# EAGLE design ControllerBoard 2 (EAGLE 5.03)
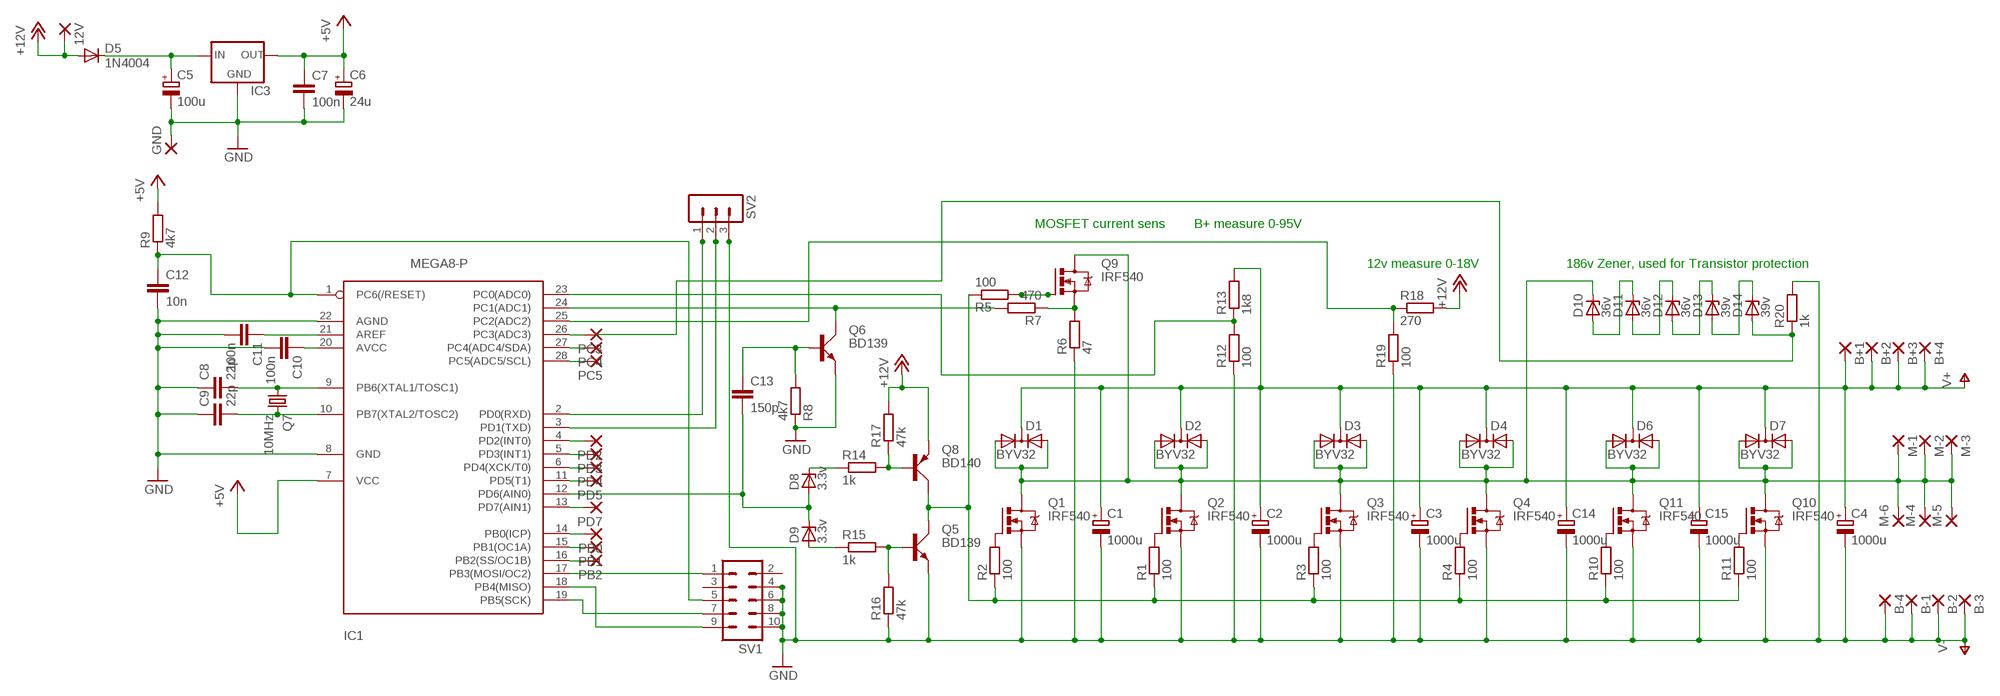
[diagram p0: schematic, sheet 1]

## Parts
12V  3,81/1,4  [3,81/1,4]
B+1  3,81/1,4  [3,81/1,4]
B+2  3,81/1,4  [3,81/1,4]
B+3  3,81/1,4  [3,81/1,4]
B+4  3,81/1,4  [3,81/1,4]
B-1  3,81/1,4  [3,81/1,4]
B-2  3,81/1,4  [3,81/1,4]
B-3  3,81/1,4  [3,81/1,4]
B-4  3,81/1,4  [3,81/1,4]
C1  1000u  CPOL-EUE7.5-16  [E7,5-16]
C2  1000u  CPOL-EUE7.5-16  [E7,5-16]
C3  1000u  CPOL-EUE7.5-16  [E7,5-16]
C4  1000u  CPOL-EUE7.5-16  [E7,5-16]
C5  100u  CPOL-EUE2.5-5  [E2,5-5]
C6  24u  CPOL-EUE2.5-5  [E2,5-5]
C7  100n  C-EU025_050-045X075  [C025_050-045X075]
C8  22p  C-EU025_050-045X075  [C025_050-045X075]
C9  22p  C-EU025_050-045X075  [C025_050-045X075]
C10  100n  C-EU025_050-045X075  [C025_050-045X075]
C11  100n  C-EU025_050-045X075  [C025_050-045X075]
C12  10n  C-EU025_050-045X075  [C025_050-045X075]
C13  150p  C-EU025_050-045X075  [C025_050-045X075]
C14  1000u  CPOL-EUE7.5-16  [E7,5-16]
C15  1000u  CPOL-EUE7.5-16  [E7,5-16]
D1  BYV32  [TO220ABS]
D2  BYV32  [TO220ABS]
D3  BYV32  [TO220ABS]
D4  BYV32  [TO220ABS]
D5  1N4004  [DO41-10]
D6  BYV32  [TO220ABS]
D7  BYV32  [TO220ABS]
D8  3.3v  BZX55  [DO35Z10]
D9  3.3v  BZX55  [DO35Z10]
D10  36v  BZX55  [DO35Z10]
D11  36v  BZX55  [DO35Z10]
D12  36v  BZX55  [DO35Z10]
D13  39v  BZX55  [DO35Z10]
D14  39v  BZX55  [DO35Z10]
GND  3,81/1,4  [3,81/1,4]
IC1  MEGA8-P  [DIL28-3]
IC3  78XXS  [78XXS]
M-1  3,81/1,4  [3,81/1,4]
M-2  3,81/1,4  [3,81/1,4]
M-3  3,81/1,4  [3,81/1,4]
M-4  3,81/1,4  [3,81/1,4]
M-5  3,81/1,4  [3,81/1,4]
M-6  3,81/1,4  [3,81/1,4]
PB0  1,6/0,9  [1,6/0,9]
PB1  1,6/0,9  [1,6/0,9]
PB2  1,6/0,9  [1,6/0,9]
PC3  1,6/0,9  [1,6/0,9]
PC4  1,6/0,9  [1,6/0,9]
PC5  1,6/0,9  [1,6/0,9]
PD2  1,6/0,9  [1,6/0,9]
PD3  1,6/0,9  [1,6/0,9]
PD4  1,6/0,9  [1,6/0,9]
PD5  1,6/0,9  [1,6/0,9]
PD7  1,6/0,9  [1,6/0,9]
Q1  IRF540  [TO220BV]
Q2  IRF540  [TO220BV]
Q3  IRF540  [TO220BV]
Q4  IRF540  [TO220BV]
Q5  BD139  [TO126AV]
Q6  BD139  [TO126AV]
Q7  10MHz  CRYSTALHC49S  [HC49/S]
Q8  BD140  [TO126AV]
Q9  IRF540  [TO220BV]
Q10  IRF540  [TO220BV]
Q11  IRF540  [TO220BV]
R1  100  R-EU_0207/10  [0207/10]
R2  100  R-EU_0207/10  [0207/10]
R3  100  R-EU_0207/10  [0207/10]
R4  100  R-EU_0207/10  [0207/10]
R5  100  R-EU_0207/10  [0207/10]
R6  47  R-EU_0207/10  [0207/10]
R7  470  R-EU_0207/10  [0207/10]
R8  4k7  R-EU_0207/10  [0207/10]
R9  4k7  R-EU_0207/10  [0207/10]
R10  100  R-EU_0207/10  [0207/10]
R11  100  R-EU_0207/10  [0207/10]
R12  100  R-EU_0207/10  [0207/10]
R13  1k8  R-EU_0207/10  [0207/10]
R14  1k  R-EU_0207/10  [0207/10]
R15  1k  R-EU_0207/10  [0207/10]
R16  47k  R-EU_0207/10  [0207/10]
R17  47k  R-EU_0207/10  [0207/10]
R18  270  R-EU_0207/10  [0207/10]
R19  100  R-EU_0207/10  [0207/10]
R20  1k  R-EU_0207/10  [0207/10]
SV1  MA05-2  [MA05-2]
SV2  MA03-1  [MA03-1]

## Nets
+5V: C6.+ C7.1 IC1.7(VCC) IC3.OUT R9.2
+12V: 12V.1(P) D5.A Q8.E R17.2 R18.2
GND: B-1.1(P) B-2.1(P) B-3.1(P) B-4.1(P) C1.- C2.- C3.- C4.- C5.- C6.- C7.2 C8.1 C9.1 C10.2 C11.2 C12.2 C14.- C15.- GND.1(P) IC1.8(GND) IC1.22(AGND) IC3.GND Q1.S Q2.S Q3.S Q4.S Q5.E Q6.E Q10.S Q11.S R6.1 R8.1 R12.1 R16.1 R19.1 R20.2 SV1.4 SV1.6 SV1.8 SV1.10 SV2.3 ; supply symbol labelled V-
M-PLUS: D1.A1 D1.A2 D2.A1 D2.A2 D3.A1 D3.A2 D4.A1 D4.A2 D6.A1 D6.A2 D7.A1 D7.A2 D10.C M-1.1(P) M-2.1(P) M-3.1(P) M-4.1(P) M-5.1(P) M-6.1(P) Q1.D Q2.D Q3.D Q4.D Q9.D Q10.D Q11.D
N$1: Q11.G R10.2
N$2: IC1.24(PC1(ADC1)) Q6.C R7.2
N$3: Q9.S R6.2 R7.1
N$4: C13.1 Q6.B R8.2
N$5: C10.1 IC1.20(AVCC)
N$6: C11.1 IC1.21(AREF)
N$7: Q2.G R1.2
N$8: Q1.G R2.2
N$9: Q3.G R3.2
N$10: Q4.G R4.2
N$11: IC1.28(PC5(ADC5/SCL)) PC5.1(P)
N$12: C8.2 IC1.9(PB6(XTAL1/TOSC1)) Q7.1
N$13: Q5.C Q8.C R1.1 R2.1 R3.1 R4.1 R5.1 R10.1 R11.1
N$14: C9.2 IC1.10(PB7(XTAL2/TOSC2)) Q7.2
N$15: Q9.G R5.2
N$16: IC1.2(PD0(RXD)) SV2.1
N$17: C5.+ D5.C IC3.IN
N$18: Q10.G R11.2
N$19: IC1.3(PD1(TXD)) SV2.2
N$20: IC1.17(PB3(MOSI/OC2)) SV1.1
N$21: IC1.19(PB5(SCK)) SV1.7
N$22: IC1.18(PB4(MISO)) SV1.9
N$23: D14.A R20.1
N$24: C13.2 D8.A D9.C IC1.12(PD6(AIN0))
N$25: C12.1 IC1.1(PC6(/RESET)) R9.1 SV1.5
N$26: IC1.23(PC0(ADC0)) R12.2 R13.1
N$27: Q8.B R14.2 R17.1
N$28: D9.A R15.1
N$29: D8.C R14.1
N$30: Q5.B R15.2 R16.2
N$31: IC1.25(PC2(ADC2)) R18.1 R19.2
N$32: IC1.11(PD5(T1)) PD5.1(P)
N$33: IC1.26(PC3(ADC3)) PC3.1(P)
N$34: IC1.27(PC4(ADC4/SDA)) PC4.1(P)
N$36: IC1.4(PD2(INT0)) PD2.1(P)
N$37: IC1.5(PD3(INT1)) PD3.1(P)
N$38: IC1.6(PD4(XCK/T0)) PD4.1(P)
N$39: D11.A D12.C
N$40: IC1.13(PD7(AIN1)) PD7.1(P)
N$41: IC1.14(PB0(ICP)) PB0.1(P)
N$42: IC1.15(PB1(OC1A)) PB1.1(P)
N$43: IC1.16(PB2(SS/OC1B)) PB2.1(P)
N$46: D13.A D14.C
N$48: D10.A D11.C
N$50: D12.A D13.C
V+: B+1.1(P) B+2.1(P) B+3.1(P) B+4.1(P) C1.+ C2.+ C3.+ C4.+ C14.+ C15.+ D1.C D2.C D3.C D4.C D6.C D7.C R13.2
Unconnected: SV1.2 SV1.3

## Notes on the sheet
- MOSFET current sens | B+ measure 0-95V
- 12v measure 0-18V | 186v Zener, used for Transistor protection

## Library data of the parts
12V B+1-B+4 B-1-B-4 GND M-1-M-6 = wirepad:3,81/1,4: THROUGH-HOLE PAD
C1-C6 C14 C15 = rcl:CPOL-EU: POLARIZED CAPACITOR, European symbol
C7-C13 = rcl:C-EU: CAPACITOR, European symbol
D1-D4 D6 D7 = diode:BYV32: DIODE 2 x Si diode 200 V, 20 A/230 Apeak, 25 ns
D5 = diode:1N4004: DIODE general purpose rectifier, 1 A
D8-D14 = diode:BZX55: Z DIODE
IC1 = atmel:MEGA8-P: MICROCONTROLLER 8 Kbytes FLASH 1 kbytes SRAM 512 bytes EEPROM USART 4-channel 10 bit ADC 2-channel 8 bit ADC Source: avr.lbr
IC3 = v-reg:78XXS: VOLTAGE REGULATOR
PB0 PB1 PB2 PC3-PC5 PD2-PD5 PD7 = wirepad:1,6/0,9: THROUGH-HOLE PAD
Q1-Q4 Q9-Q11 = transistor-power:IRF540: HEXFET Power MOSFET
Q5 Q6 = transistor-power:BD139: NPN TRANSISTOR
Q7 = crystal:CRYSTAL: CRYSTAL
Q8 = transistor-power:BD140: PNP TRANSISTOR
R1-R20 = rcl:R-EU_: RESISTOR, European symbol
SV1 = con-lstb:MA05-2: PIN HEADER
SV2 = con-lstb:MA03-1: PIN HEADER

## Board
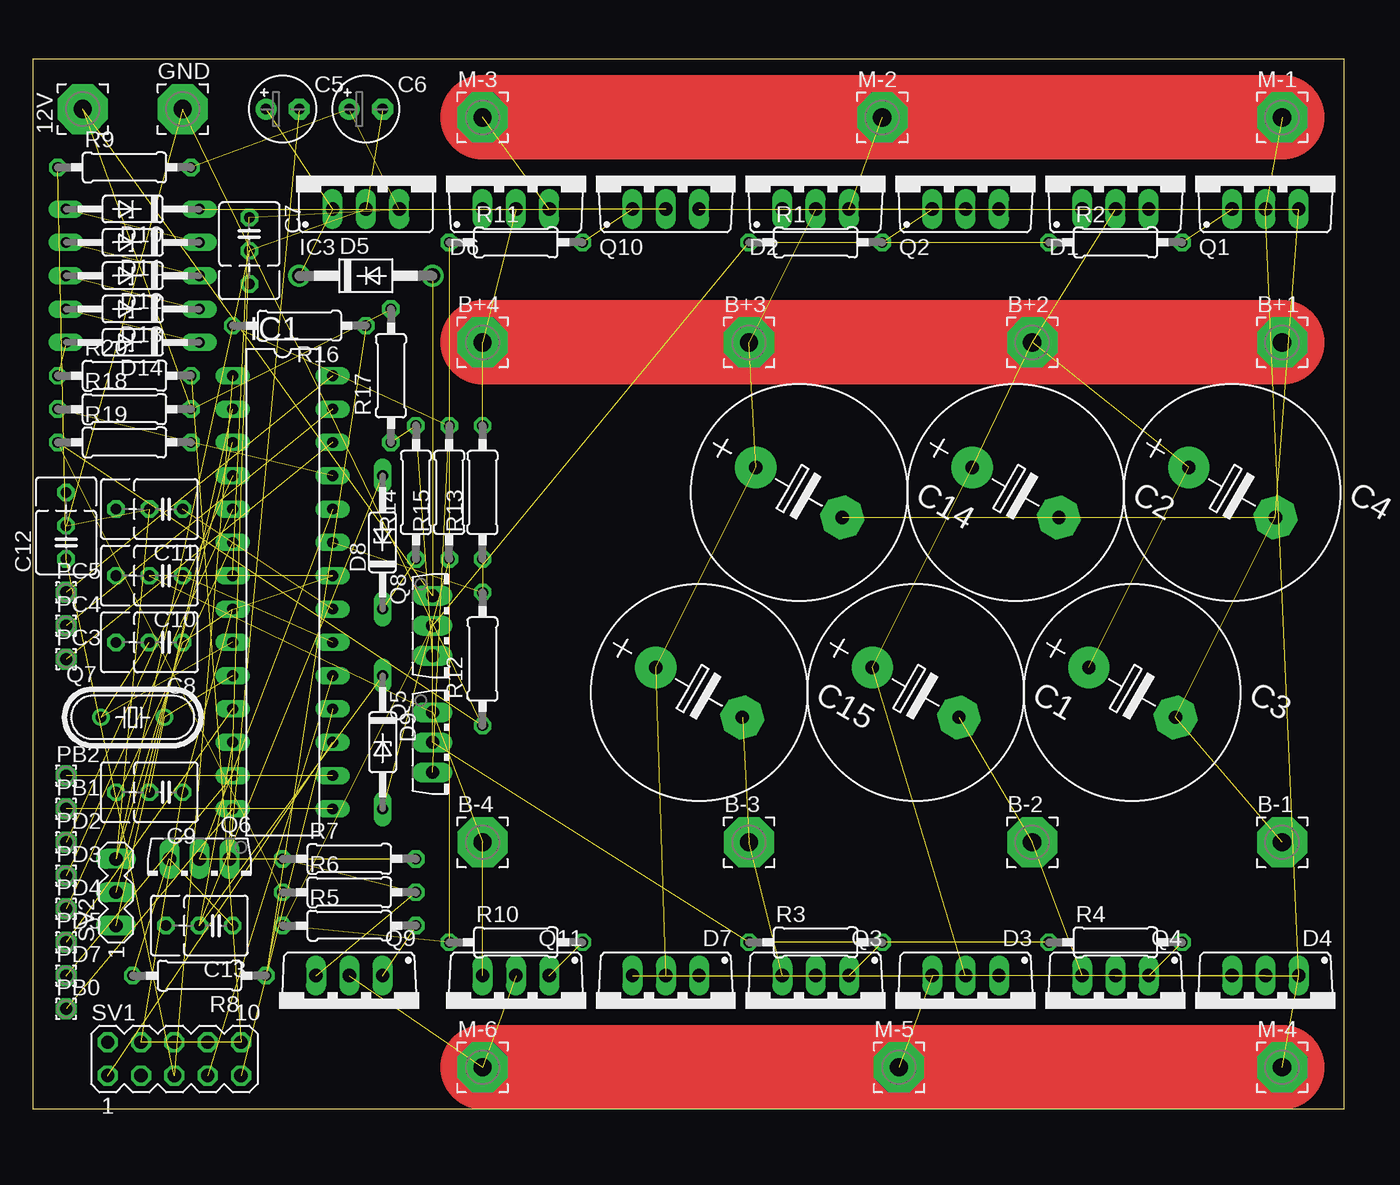
[diagram p1: board, top side]
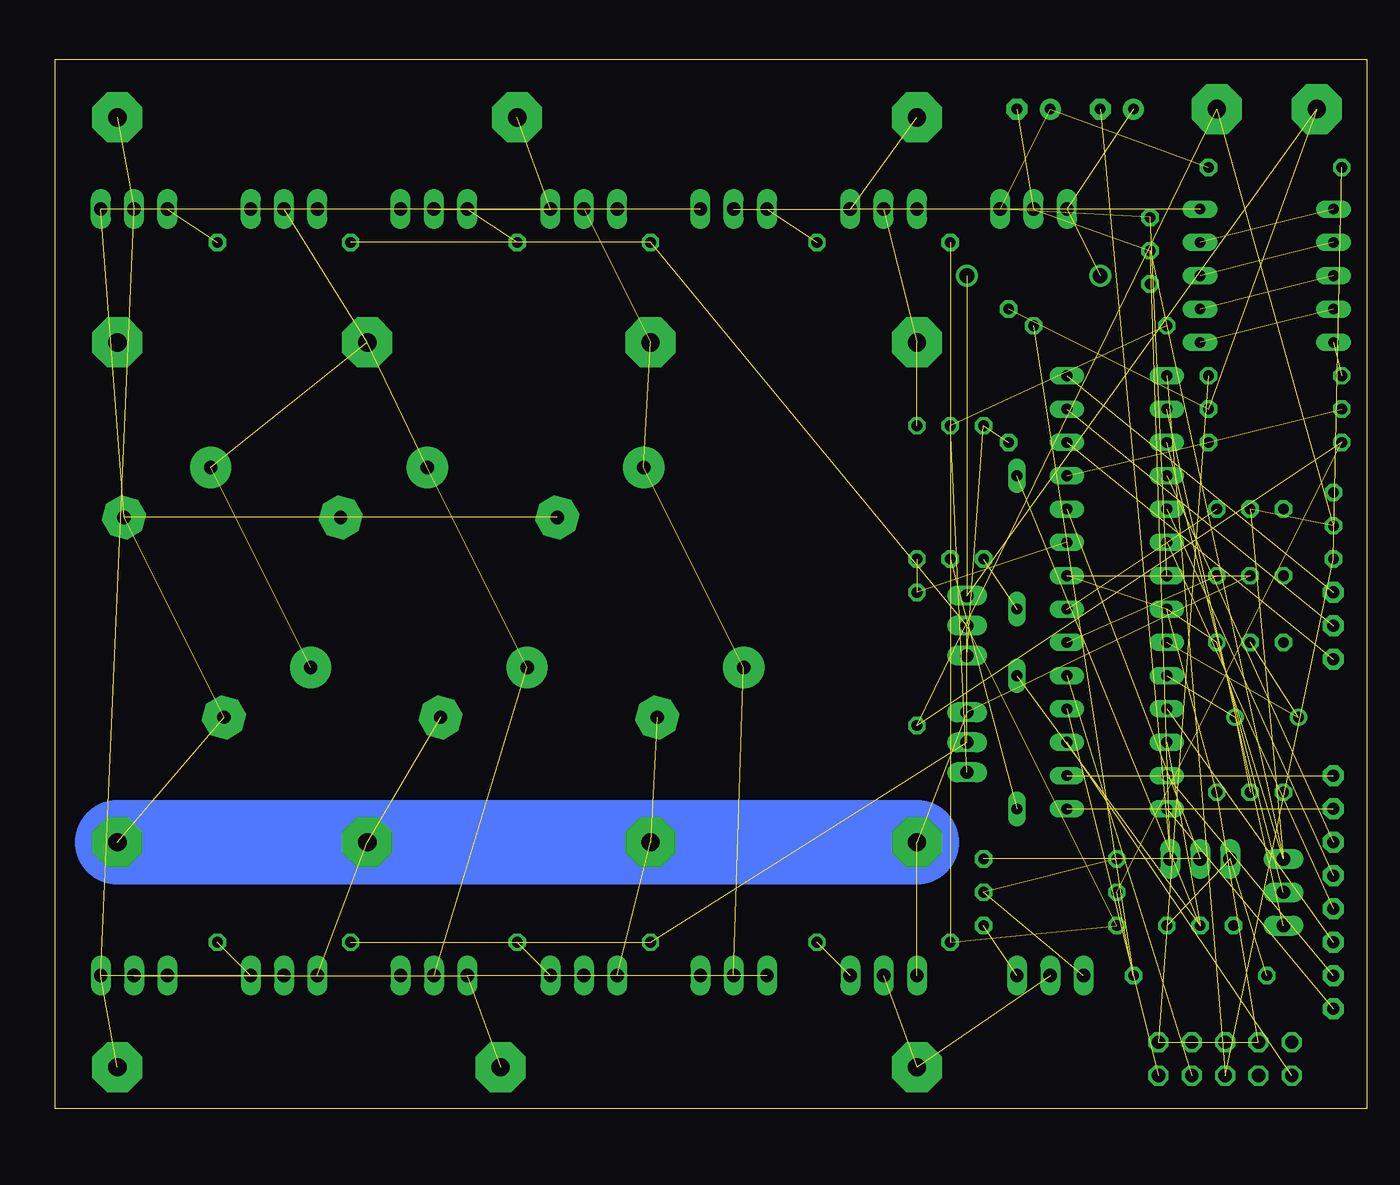
[diagram p2: board, bottom side, seen from below]

Size 100 x 80 mm. Coordinates in mm from the lower left corner, seen from the top.
Outline: 0,0 100,0 100,80 0,80 0,0
Copper layers (1*16): Top 0.035mm / dielectric 1.5mm / Bottom 0.035mm
Design rules "default": minimum track width 10mil, minimum drill 24mil, track to track 8mil, track to pad 8mil, pad to pad 8mil, via to via 8mil, smd to smd 8mil, copper to edge 40mil, drill to drill 8mil, minimum pad ring 10mil, minimum via ring 8mil, stop-mask expansion 4mil, vias tented up to drill 0mil, thermal gap 10mil

### Footprints (pad centres in the part's own frame; a part is rotated, then mirrored left to right if it is on the bottom)
3,81/1,4 = drill 1.397 pad 3.81 octagon: 1 0,0
E7,5-16 = drill 1.016 pad 3.15 round: + -3.81,0 | drill 1.016 pad 3.15 octagon: - 3.81,0
E2,5-5 = drill 0.813 pad 1.6 round: + -1.27,0 | drill 0.813 pad 1.6 octagon: - 1.27,0
C025_050-045X075 = drill 0.813 octagon: 1 -1.27,0; 2 1.27,0; 3 3.81,0
TO220ABS = drill 1.016 long: A1 -2.54,-2.54; A2 2.54,-2.54; C 0,-2.54
DO41-10 = drill 1.118 round: A 5.08,0; C -5.08,0
DO35Z10 = drill 0.813 long: A 5.08,0; C -5.08,0
DIL28-3 = drill 0.813 long: 1 -16.51,-3.81; 2 -13.97,-3.81; 3 -11.43,-3.81; 4 -8.89,-3.81; 5 -6.35,-3.81; 6 -3.81,-3.81; 7 -1.27,-3.81; 8 1.27,-3.81; 9 3.81,-3.81; 10 6.35,-3.81; 11 8.89,-3.81; 12 11.43,-3.81; 13 13.97,-3.81; 14 16.51,-3.81; 15 16.51,3.81; 16 13.97,3.81; 17 11.43,3.81; 18 8.89,3.81; 19 6.35,3.81; 20 3.81,3.81; 21 1.27,3.81; 22 -1.27,3.81; 23 -3.81,3.81; 24 -6.35,3.81; 25 -8.89,3.81; 26 -11.43,3.81; 27 -13.97,3.81; 28 -16.51,3.81
78XXS = drill 1.016 long: GND 0,-2.54; IN -2.54,-2.54; OUT 2.54,-2.54
1,6/0,9 = drill 0.914 pad 1.6 octagon: 1 0,0
TO220BV = drill 1.016 long: D 0,-2.54; G -2.54,-2.54; S 2.54,-2.54
TO126AV = drill 1.016 long: B 2.286,-1.27; C 0,-1.27; E -2.286,-1.27
HC49/S = drill 0.813 round: 1 -2.413,0; 2 2.413,0
0207/10 = drill 0.813 octagon: 1 -5.08,0; 2 5.08,0
MA05-2 = drill 1.016 octagon: 1 -5.08,-1.27; 2 -5.08,1.27; 3 -2.54,-1.27; 4 -2.54,1.27; 5 0,-1.27; 6 0,1.27; 7 2.54,-1.27; 8 2.54,1.27; 9 5.08,-1.27; 10 5.08,1.27
MA03-1 = drill 1.016 long: 1 -2.54,0; 2 0,0; 3 2.54,0

### Placement (x,y rotation side)
12V  3.81,76.2 90 top
B+1  95.25,58.42 0 top
B+2  76.2,58.42 0 top
B+3  54.61,58.42 0 top
B+4  34.29,58.42 0 top
B-1  95.25,20.32 0 top
B-2  76.2,20.32 0 top
B-3  54.61,20.32 0 top
B-4  34.29,20.32 0 top
C1  67.31,31.75 330 top
C2  74.93,46.99 330 top
C3  83.82,31.75 330 top
C4  91.44,46.99 330 top
C5  19.05,76.2 0 top
C6  25.4,76.2 0 top
C7  16.51,66.67 270 top
C8  10.16,35.56 180 top
C9  10.16,24.13 180 top
C10  10.16,40.64 180 top
C11  10.16,45.72 180 top
C12  2.54,43.18 90 top
C13  13.97,13.97 180 top
C14  58.42,46.99 330 top
C15  50.8,31.75 330 top
D1  82.55,71.12 0 top
D2  59.69,71.12 0 top
D3  71.12,7.62 180 top
D4  93.98,7.62 180 top
D5  25.4,63.5 0 top
D6  36.83,71.12 0 top
D7  48.26,7.62 180 top
D8  26.67,43.18 90 top
D9  26.67,27.94 270 top
D10  7.62,68.58 180 top
D11  7.62,66.04 180 top
D12  7.62,63.5 180 top
D13  7.62,60.96 180 top
D14  7.62,58.42 180 top
GND  11.43,76.2 0 top
IC1  19.05,39.37 270 top
IC3  25.4,71.12 0 top
M-1  95.25,75.56 0 top
M-2  64.77,75.56 0 top
M-3  34.29,75.56 0 top
M-4  95.25,3.17 0 top
M-5  66.04,3.17 0 top
M-6  34.29,3.17 0 top
PB0  2.54,7.62 0 top
PB1  2.54,22.86 0 top
PB2  2.54,25.4 0 top
PC3  2.54,34.29 0 top
PC4  2.54,36.83 0 top
PC5  2.54,39.37 0 top
PD2  2.54,20.32 0 top
PD3  2.54,17.78 0 top
PD4  2.54,15.24 0 top
PD5  2.54,12.7 0 top
PD7  2.54,10.16 0 top
Q1  93.98,71.12 0 top
Q2  71.12,71.12 0 top
Q3  59.69,7.62 180 top
Q4  82.55,7.62 180 top
Q5  31.75,27.94 270 top
Q6  12.7,17.78 180 top
Q7  7.62,29.84 0 top
Q8  31.75,36.83 270 top
Q9  24.13,7.62 180 top
Q10  48.26,71.12 0 top
Q11  36.83,7.62 180 top
R1  59.69,66.04 0 top
R2  82.55,66.04 0 top
R3  59.69,12.7 0 top
R4  82.55,12.7 0 top
R5  24.13,13.97 0 top
R6  24.13,16.51 0 top
R7  24.13,19.05 0 top
R8  12.7,10.16 180 top
R9  6.99,71.75 0 top
R10  36.83,12.7 0 top
R11  36.83,66.04 0 top
R12  34.29,34.29 90 top
R13  34.29,46.99 90 top
R14  29.21,46.99 90 top
R15  31.75,46.99 90 top
R16  20.32,59.69 180 top
R17  27.3,55.88 90 top
R18  6.99,53.34 0 top
R19  6.99,50.8 0 top
R20  6.99,55.88 0 top
SV1  10.79,3.81 0 top
SV2  6.35,16.51 90 top

### Tracks (layer width: path | path; a pad name or v marks a point on that pad's centre or on a via)
+5V  (4 unrouted)
+12V  (4 unrouted)
GND  (37 unrouted)
  Bottom 6.452: B-1.1 B-2.1 B-3.1 B-4.1
M-PLUS  (21 unrouted)
  Top 6.452: M-3.1 M-2.1 M-1.1 | M-6.1 M-5.1 M-4.1
N$1  (1 unrouted)
N$2  (2 unrouted)
N$3  (2 unrouted)
N$4  (2 unrouted)
N$5  (1 unrouted)
N$6  (1 unrouted)
N$7  (1 unrouted)
N$8  (1 unrouted)
N$9  (1 unrouted)
N$10  (1 unrouted)
N$11  (1 unrouted)
N$12  (2 unrouted)
N$13  (8 unrouted)
N$14  (2 unrouted)
N$15  (1 unrouted)
N$16  (1 unrouted)
N$17  (2 unrouted)
N$18  (1 unrouted)
N$19  (1 unrouted)
N$20  (1 unrouted)
N$21  (1 unrouted)
N$22  (1 unrouted)
N$23  (1 unrouted)
N$24  (3 unrouted)
N$25  (3 unrouted)
N$26  (2 unrouted)
N$27  (2 unrouted)
N$28  (1 unrouted)
N$29  (1 unrouted)
N$30  (2 unrouted)
N$31  (2 unrouted)
N$32  (1 unrouted)
N$33  (1 unrouted)
N$34  (1 unrouted)
N$36  (1 unrouted)
N$37  (1 unrouted)
N$38  (1 unrouted)
N$39  (1 unrouted)
N$40  (1 unrouted)
N$41  (1 unrouted)
N$42  (1 unrouted)
N$43  (1 unrouted)
N$46  (1 unrouted)
N$48  (1 unrouted)
N$50  (1 unrouted)
V+  (13 unrouted)
  Top 6.452: B+1.1 B+2.1 B+3.1 B+4.1